# EAGLE design Gadgeteer Sponsor Board (EAGLE 6.1)
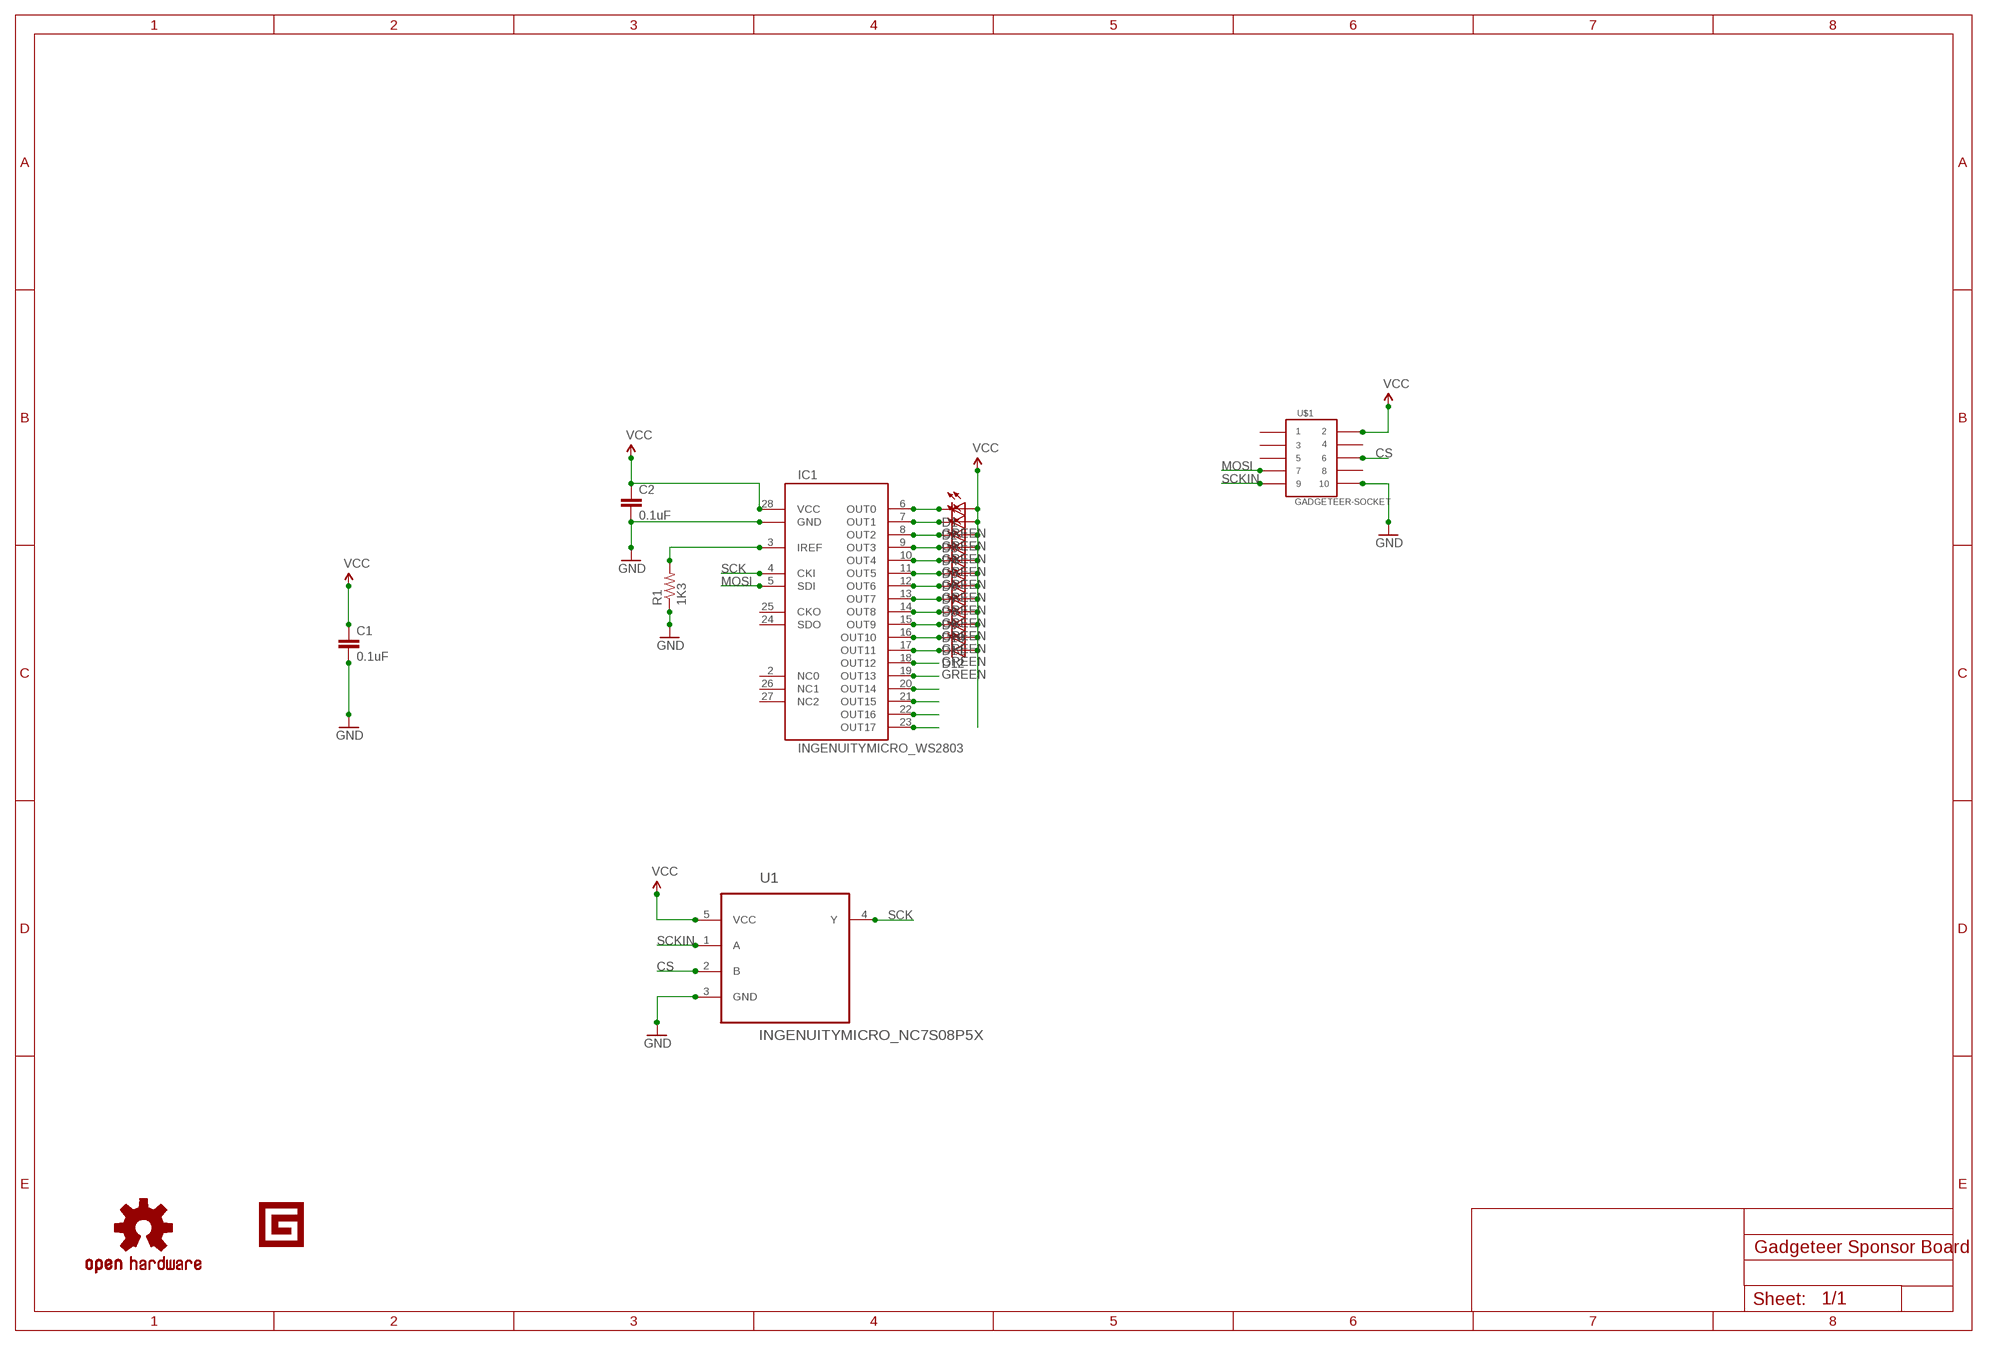
[diagram p0: schematic, sheet 1]

## Parts
C1  0.1uF  SPARKFUN_CAP0603-CAP  [SPARKFUN_0603-CAP]
C2  0.1uF  SPARKFUN_CAP0603-CAP  [SPARKFUN_0603-CAP]
D1  GREEN  LED-GREEN0603  [LED-0603]
D2  GREEN  LED-GREEN0603  [LED-0603]
D3  GREEN  LED-GREEN0603  [LED-0603]
D4  GREEN  LED-GREEN0603  [LED-0603]
D5  GREEN  LED-GREEN0603  [LED-0603]
D6  GREEN  LED-GREEN0603  [LED-0603]
D7  GREEN  LED-GREEN0603  [LED-0603]
D8  GREEN  LED-GREEN0603  [LED-0603]
D9  GREEN  LED-GREEN0603  [LED-0603]
D10  GREEN  LED-GREEN0603  [LED-0603]
D11  GREEN  LED-GREEN0603  [LED-0603]
D12  GREEN  LED-GREEN0603  [LED-0603]
IC1  INGENUITYMICRO_WS2803  [INGENUITYMICRO_SO28W]
LOGO1  OSHW-LOGOL  [OSHW-LOGO-L]
R1  1K3  RESISTOR_R-US_R0603  [RESISTOR_R0603]
U1  INGENUITYMICRO_NC7S08P5X  [INGENUITYMICRO_SOT65P210X110-5N]
U$1  GADGETEER-SOCKET  [2X5_1.27MM]
U$2  INGENUITYMICRO_LOGO_LOGO-GADGETEER-NORMAL  [INGENUITYMICRO_LOGO_GADGETEER-SILK]

## Nets
CS: U1.2(B) U$1.6
GND: C1.2 C2.2 IC1.1(GND) R1.1 U1.3(GND) U$1.10
MOSI: IC1.5(SDI) U$1.7
N$1: D1.C IC1.6(OUT0)
N$2: D2.C IC1.7(OUT1)
N$3: IC1.3(IREF) R1.2
N$4: D3.C IC1.8(OUT2)
N$5: D4.C IC1.9(OUT3)
N$6: D5.C IC1.10(OUT4)
N$7: D6.C IC1.11(OUT5)
N$8: D7.C IC1.12(OUT6)
N$9: D8.C IC1.13(OUT7)
N$10: D9.C IC1.14(OUT8)
N$11: D10.C IC1.15(OUT9)
N$12: D11.C IC1.16(OUT10)
N$13: D12.C IC1.17(OUT11)
N$14: IC1.18(OUT12)
N$15: IC1.19(OUT13)
N$16: IC1.20(OUT14)
N$17: IC1.21(OUT15)
N$18: IC1.22(OUT16)
N$19: IC1.23(OUT17)
SCK: IC1.4(CKI) U1.4(Y)
SCKIN: U1.1(A) U$1.9
VCC: C1.1 C2.1 D1.A D2.A D3.A D4.A D5.A D6.A D7.A D8.A D9.A D10.A D11.A D12.A IC1.28(VCC) U1.5(VCC) U$1.2
Unconnected: IC1.2(NC0) IC1.24(SDO) IC1.25(CKO) IC1.26(NC1) IC1.27(NC2) U$1.1 U$1.3 U$1.4 U$1.5 U$1.8

## Library data of the parts
C1 C2 = Level:SPARKFUN_CAP: Capacitor Standard 0603 ceramic capacitor, and 0.1" leaded capacitor.
D1-D12 = SparkFun-LED:LED-GREEN: Various green LEDs 0603- DIO-00821 LARGE- DIO-00862 LILYPAD- DIO-09910; PROD_ID: DIO-00821
IC1 = Level:INGENUITYMICRO_WS2803: WS2803 18-Channel Constant Current LED Driver with Programmable PWM Outputs Manufactured by Worldsemi
LOGO1 = SparkFun-Aesthetics:OSHW-LOGO: Open Source Hardware Logo This logo indicates the piece of hardware it is found on incorporates a OSHW license and/or adheres to the definition of open source hardware found here: http://freedomdefined.org/OSHW
R1 = Level:RESISTOR_R-US_: RESISTOR, American symbol
U1 = Level:INGENUITYMICRO_NC7S08P5X: 2 Input AND Gate; MPN: NC7S08P5X; OC_FARNELL: 1417655; OC_NEWARK: 58K1992; PACKAGE: SC-70-5; SUPPLIER: Fairchild Semiconductor
U$1 = SoftDust:GADGETEER-SOCKET
U$2 = Level:INGENUITYMICRO_LOGO_LOGO-GADGETEER

## Board
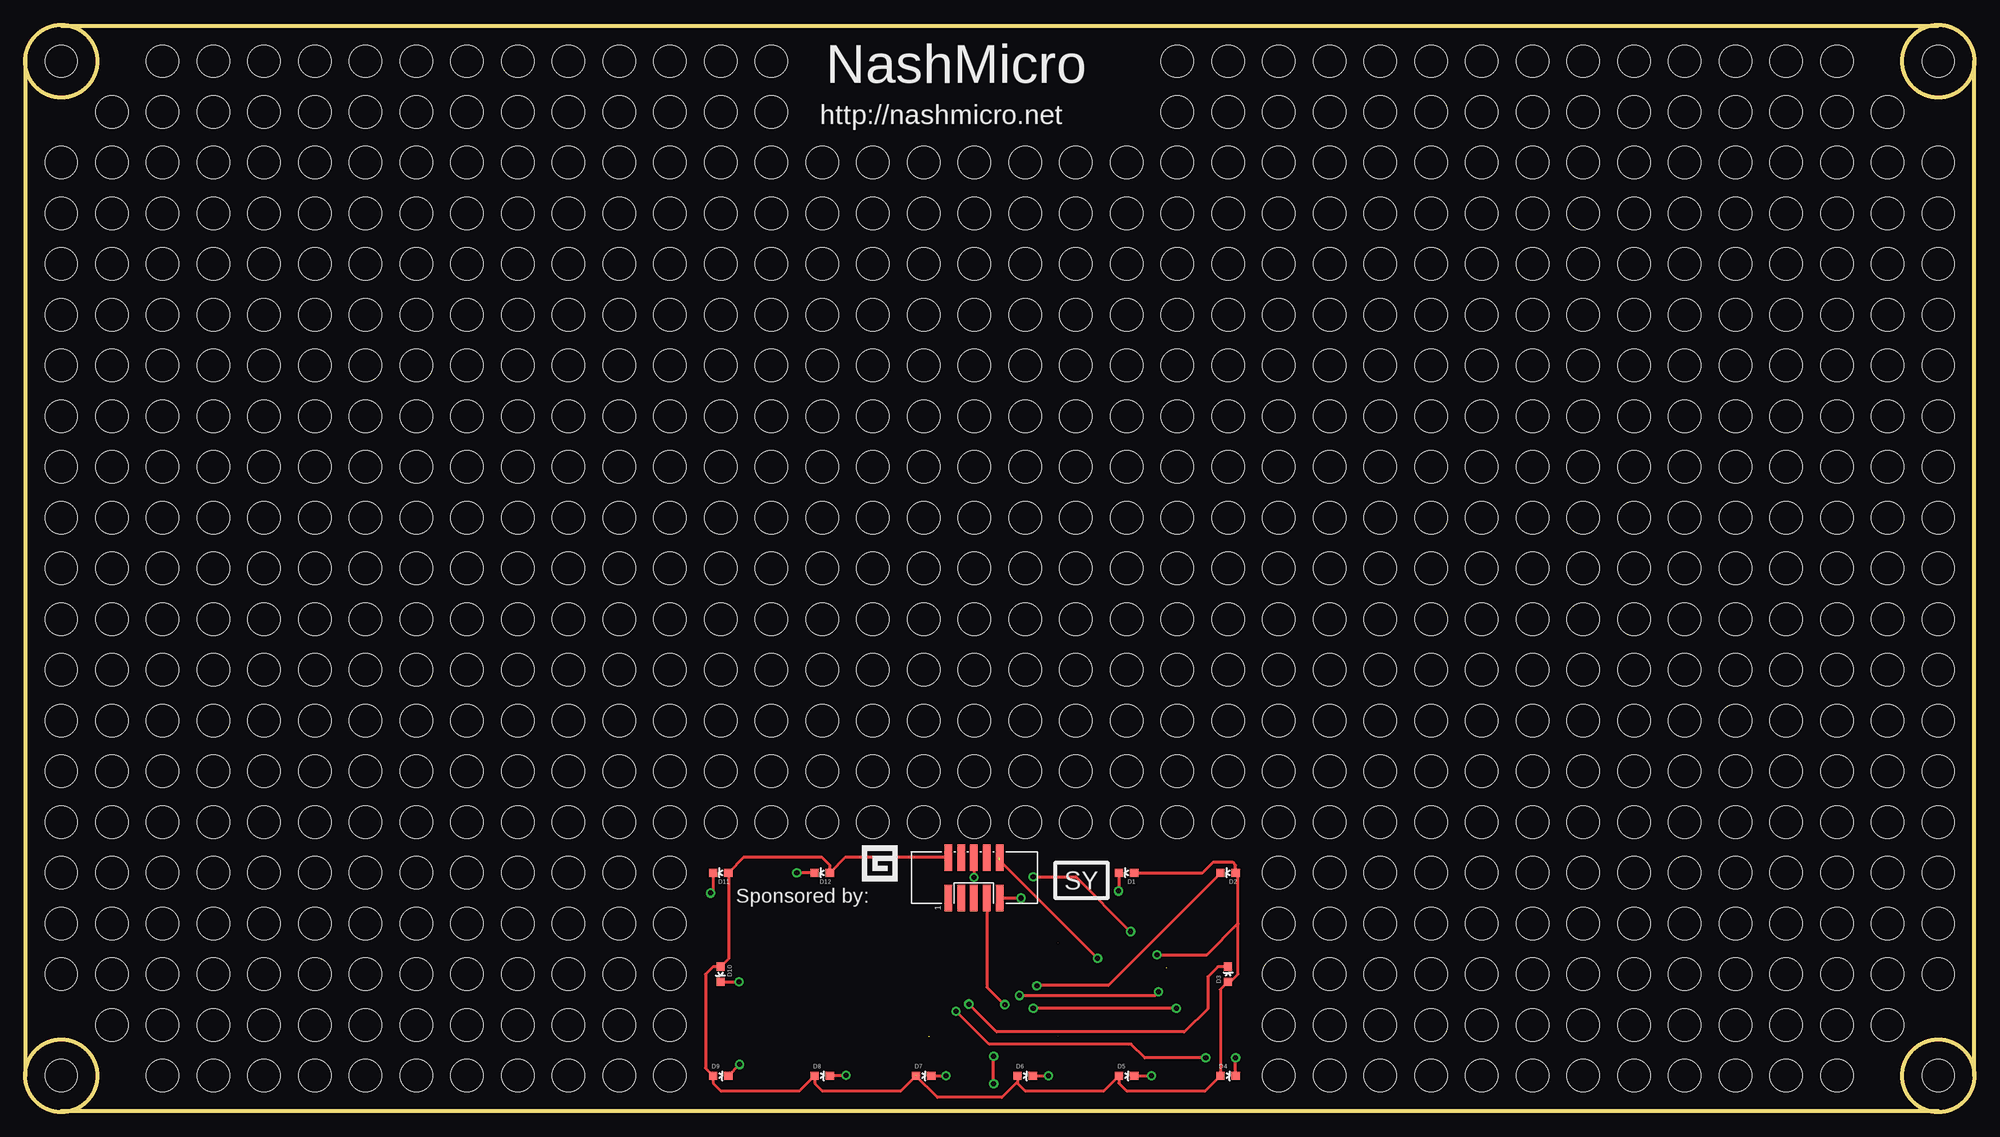
[diagram p1: board, top side]
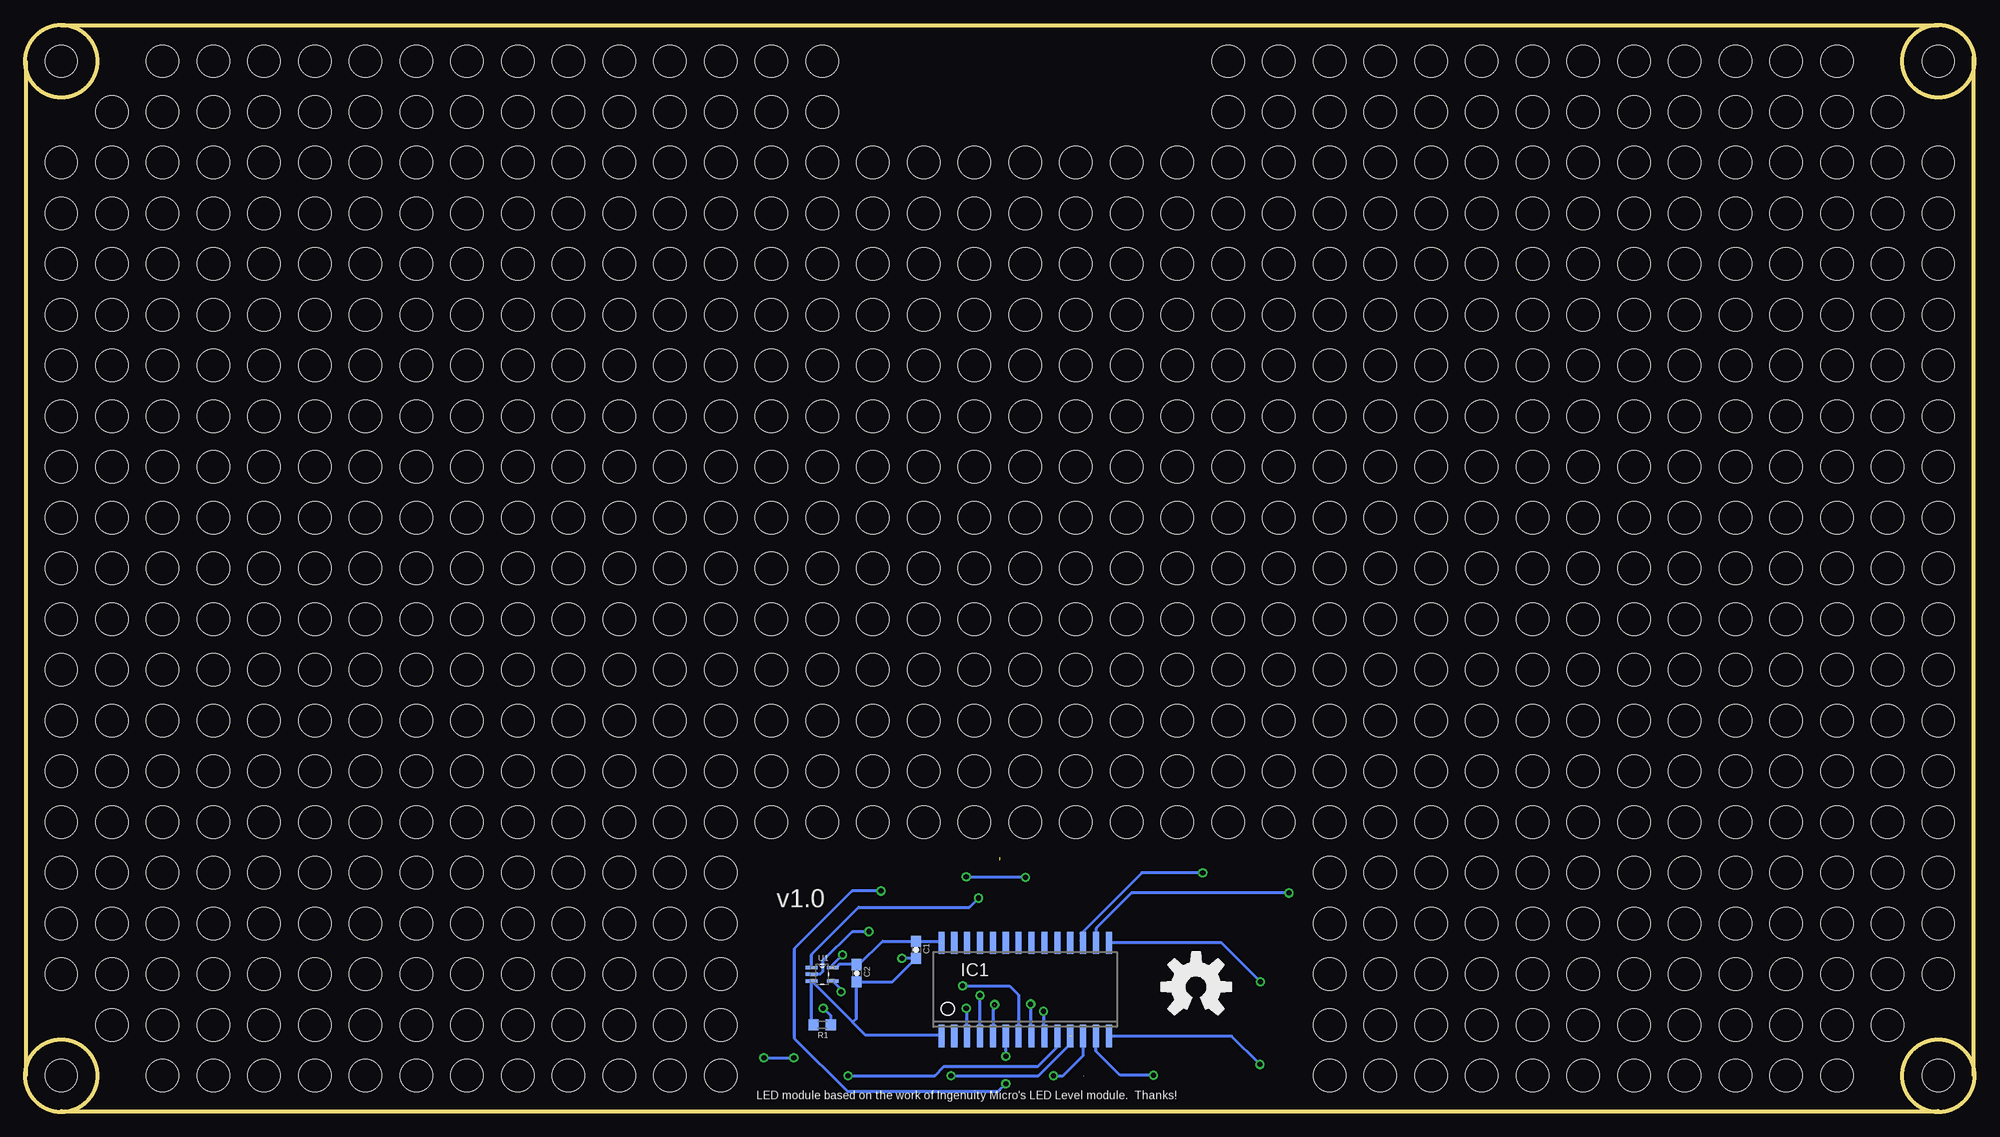
[diagram p2: board, bottom side, seen from below]

Size 192.07 x 107.07 mm. Coordinates in mm from the lower left corner, seen from the top.
Outline: 3.54,107.04 188.54,107.04
Outline: 192.04,103.54 192.04,3.54
Outline: 188.54,0.04 3.54,0.04
Outline: 0.04,3.54 0.04,104.04
Outline: circle at 3.54,103.54 radius 3.54
Outline: circle at 188.54,103.54 radius 3.54
Outline: circle at 3.54,3.54 radius 3.54
Outline: circle at 188.54,3.54 radius 3.54
Copper layers (1*16): Top 0.035mm / dielectric 1.5mm / Bottom 0.035mm
Design rules: minimum track width 6mil, minimum drill 12mil, track to track 6mil, track to pad 6mil, pad to pad 6mil, via to via 6mil, smd to smd 0mil, copper to edge 10mil, drill to drill 10mil, minimum pad ring 12mil, minimum via ring 8mil, stop-mask expansion 2mil, vias tented up to drill 25mil, thermal gap 10mil
Holes 3.2 mm at 3.54,103.54 13.54,103.54 18.54,103.54 23.54,103.54 28.54,103.54 33.54,103.54 38.54,103.54 43.54,103.54 48.54,103.54 3.54,93.54 8.54,93.54 13.54,93.54 18.54,93.54 23.54,93.54 28.54,93.54 33.54,93.54 38.54,93.54 43.54,93.54 48.54,93.54 53.54,93.54 58.54,93.54 63.54,93.54 68.54,93.54 73.54,93.54 78.54,93.54 83.54,93.54 88.54,93.54 93.54,93.54 98.54,93.54 103.54,93.54 108.54,93.54 113.54,93.54 118.54,93.54 123.54,93.54 128.54,93.54 133.54,93.54 138.54,93.54 143.54,93.54 148.54,93.54 153.54,93.54 158.54,93.54 163.54,93.54 168.54,93.54 173.54,93.54 178.54,93.54 183.54,93.54 188.54,93.54 188.54,103.54 3.54,3.54 188.54,3.54 8.54,98.54 13.54,98.54 18.54,98.54 23.54,98.54 28.54,98.54 33.54,98.54 38.54,98.54 43.54,98.54 48.54,98.54 53.54,98.54 58.54,98.54 63.54,98.54 68.54,98.54 73.54,98.54 113.54,98.54 118.54,98.54 123.54,98.54 128.54,98.54 133.54,98.54 138.54,98.54 143.54,98.54 148.54,98.54 153.54,98.54 158.54,98.54 163.54,98.54 168.54,98.54 173.54,98.54 178.54,98.54 183.54,98.54 53.54,103.54 58.54,103.54 63.54,103.54 68.54,103.54 73.54,103.54 113.54,103.54 118.54,103.54 123.54,103.54 128.54,103.54 133.54,103.54 138.54,103.54 143.54,103.54 148.54,103.54 153.54,103.54 158.54,103.54 163.54,103.54 168.54,103.54 173.54,103.54 178.54,103.54 3.54,88.54 8.54,88.54 13.54,88.54 18.54,88.54 23.54,88.54 28.54,88.54 33.54,88.54 38.54,88.54 43.54,88.54 48.54,88.54 53.54,88.54 58.54,88.54 63.54,88.54 68.54,88.54 73.54,88.54 78.54,88.54 83.54,88.54 88.54,88.54 93.54,88.54 98.54,88.54 103.54,88.54 108.54,88.54 113.54,88.54 118.54,88.54 123.54,88.54 128.54,88.54 133.54,88.54 138.54,88.54 143.54,88.54 148.54,88.54 153.54,88.54 158.54,88.54 163.54,88.54 168.54,88.54 173.54,88.54 178.54,88.54 183.54,88.54 188.54,88.54 3.54,83.54 8.54,83.54 13.54,83.54 18.54,83.54 23.54,83.54 28.54,83.54 33.54,83.54 38.54,83.54 43.54,83.54 48.54,83.54 53.54,83.54 58.54,83.54 63.54,83.54 68.54,83.54 73.54,83.54 78.54,83.54 83.54,83.54 88.54,83.54 93.54,83.54 98.54,83.54 103.54,83.54 108.54,83.54 113.54,83.54 118.54,83.54 123.54,83.54 128.54,83.54 133.54,83.54 138.54,83.54 143.54,83.54 148.54,83.54 153.54,83.54 158.54,83.54 163.54,83.54 168.54,83.54 173.54,83.54 178.54,83.54 183.54,83.54 188.54,83.54 3.54,78.54 8.54,78.54 13.54,78.54 18.54,78.54 23.54,78.54 28.54,78.54 33.54,78.54 38.54,78.54 43.54,78.54 48.54,78.54 53.54,78.54 58.54,78.54 63.54,78.54 68.54,78.54 73.54,78.54 78.54,78.54 83.54,78.54 88.54,78.54 93.54,78.54 98.54,78.54 103.54,78.54 108.54,78.54 113.54,78.54 118.54,78.54 123.54,78.54 128.54,78.54 133.54,78.54 138.54,78.54 143.54,78.54 148.54,78.54 153.54,78.54 158.54,78.54 163.54,78.54 168.54,78.54 173.54,78.54 178.54,78.54 183.54,78.54 188.54,78.54 3.54,73.54 8.54,73.54 13.54,73.54 18.54,73.54 23.54,73.54 28.54,73.54 33.54,73.54 38.54,73.54 43.54,73.54 48.54,73.54 53.54,73.54 58.54,73.54 63.54,73.54 68.54,73.54 73.54,73.54 78.54,73.54 83.54,73.54 88.54,73.54 93.54,73.54 98.54,73.54 103.54,73.54 108.54,73.54 113.54,73.54 118.54,73.54 123.54,73.54 128.54,73.54 133.54,73.54 138.54,73.54 143.54,73.54 148.54,73.54 153.54,73.54 158.54,73.54 163.54,73.54 168.54,73.54 173.54,73.54 178.54,73.54 183.54,73.54 188.54,73.54 3.54,68.54 8.54,68.54 13.54,68.54 18.54,68.54 23.54,68.54 28.54,68.54 33.54,68.54 38.54,68.54 43.54,68.54 48.54,68.54 53.54,68.54 58.54,68.54 63.54,68.54 68.54,68.54 73.54,68.54 78.54,68.54 83.54,68.54 88.54,68.54 93.54,68.54 98.54,68.54 103.54,68.54 108.54,68.54 113.54,68.54 118.54,68.54 123.54,68.54 128.54,68.54 133.54,68.54 138.54,68.54 143.54,68.54 148.54,68.54 153.54,68.54 158.54,68.54 163.54,68.54 168.54,68.54 173.54,68.54 178.54,68.54 183.54,68.54 188.54,68.54 3.54,63.54 8.54,63.54 13.54,63.54 18.54,63.54 23.54,63.54 28.54,63.54 33.54,63.54 38.54,63.54 43.54,63.54 48.54,63.54 53.54,63.54 58.54,63.54 63.54,63.54 68.54,63.54 73.54,63.54 78.54,63.54 83.54,63.54 88.54,63.54 93.54,63.54 98.54,63.54 103.54,63.54 108.54,63.54 113.54,63.54 118.54,63.54 123.54,63.54 128.54,63.54 133.54,63.54 138.54,63.54 143.54,63.54 148.54,63.54 153.54,63.54 158.54,63.54 163.54,63.54 168.54,63.54 173.54,63.54 178.54,63.54 183.54,63.54 188.54,63.54 3.54,58.54 8.54,58.54 13.54,58.54 18.54,58.54 23.54,58.54 28.54,58.54 33.54,58.54 38.54,58.54 43.54,58.54 48.54,58.54 53.54,58.54 58.54,58.54 63.54,58.54 68.54,58.54 73.54,58.54 78.54,58.54 83.54,58.54 88.54,58.54 93.54,58.54 98.54,58.54 103.54,58.54 108.54,58.54 113.54,58.54 118.54,58.54 123.54,58.54 128.54,58.54 133.54,58.54 138.54,58.54 143.54,58.54 148.54,58.54 153.54,58.54 158.54,58.54 163.54,58.54 168.54,58.54 173.54,58.54 178.54,58.54 183.54,58.54 188.54,58.54 3.54,53.54 8.54,53.54 13.54,53.54 18.54,53.54 23.54,53.54 28.54,53.54 33.54,53.54 38.54,53.54 43.54,53.54 48.54,53.54 53.54,53.54 58.54,53.54 63.54,53.54 68.54,53.54 73.54,53.54 78.54,53.54 83.54,53.54 88.54,53.54 93.54,53.54 98.54,53.54 103.54,53.54 108.54,53.54 113.54,53.54 118.54,53.54 123.54,53.54 128.54,53.54 133.54,53.54 138.54,53.54 143.54,53.54 148.54,53.54 153.54,53.54 158.54,53.54 163.54,53.54 168.54,53.54 173.54,53.54 178.54,53.54 183.54,53.54 188.54,53.54 3.54,48.54 8.54,48.54 13.54,48.54 18.54,48.54 23.54,48.54 28.54,48.54 33.54,48.54 38.54,48.54 43.54,48.54 48.54,48.54 53.54,48.54 58.54,48.54 63.54,48.54 68.54,48.54 73.54,48.54 78.54,48.54 83.54,48.54 88.54,48.54 93.54,48.54 98.54,48.54 103.54,48.54 108.54,48.54 113.54,48.54 118.54,48.54 123.54,48.54 128.54,48.54 133.54,48.54 138.54,48.54 143.54,48.54 148.54,48.54 153.54,48.54 158.54,48.54 163.54,48.54 168.54,48.54 173.54,48.54 178.54,48.54 183.54,48.54 188.54,48.54 3.54,43.54 8.54,43.54 13.54,43.54 18.54,43.54 23.54,43.54 28.54,43.54 33.54,43.54 38.54,43.54 43.54,43.54 48.54,43.54 53.54,43.54 58.54,43.54 63.54,43.54 68.54,43.54 73.54,43.54 78.54,43.54 83.54,43.54 88.54,43.54 93.54,43.54 98.54,43.54 103.54,43.54 108.54,43.54 113.54,43.54 118.54,43.54 123.54,43.54 128.54,43.54 133.54,43.54 138.54,43.54 143.54,43.54 148.54,43.54 153.54,43.54 158.54,43.54 163.54,43.54 168.54,43.54 173.54,43.54 178.54,43.54 183.54,43.54 188.54,43.54 3.54,38.54 8.54,38.54 13.54,38.54 18.54,38.54 23.54,38.54 28.54,38.54 33.54,38.54 38.54,38.54 43.54,38.54 48.54,38.54 53.54,38.54 58.54,38.54 63.54,38.54 68.54,38.54 73.54,38.54 78.54,38.54 83.54,38.54 88.54,38.54 93.54,38.54 98.54,38.54 103.54,38.54 108.54,38.54 113.54,38.54 118.54,38.54 123.54,38.54 128.54,38.54 133.54,38.54 138.54,38.54 143.54,38.54 148.54,38.54 153.54,38.54 158.54,38.54 163.54,38.54 168.54,38.54 173.54,38.54 178.54,38.54 183.54,38.54 188.54,38.54 3.54,33.54 8.54,33.54 13.54,33.54 18.54,33.54 23.54,33.54 28.54,33.54 33.54,33.54 38.54,33.54 43.54,33.54 48.54,33.54 53.54,33.54 58.54,33.54 63.54,33.54 68.54,33.54 73.54,33.54 78.54,33.54 83.54,33.54 88.54,33.54 93.54,33.54 98.54,33.54 103.54,33.54 108.54,33.54 113.54,33.54 118.54,33.54 123.54,33.54 128.54,33.54 133.54,33.54 138.54,33.54 143.54,33.54 148.54,33.54 153.54,33.54 158.54,33.54 163.54,33.54 168.54,33.54 173.54,33.54 178.54,33.54 183.54,33.54 188.54,33.54 3.54,28.54 8.54,28.54 13.54,28.54 18.54,28.54 23.54,28.54 28.54,28.54 33.54,28.54 38.54,28.54 43.54,28.54 48.54,28.54 53.54,28.54 58.54,28.54 63.54,28.54 68.54,28.54 73.54,28.54 78.54,28.54 83.54,28.54 88.54,28.54 93.54,28.54 98.54,28.54 103.54,28.54 108.54,28.54 113.54,28.54 118.54,28.54 123.54,28.54 128.54,28.54 133.54,28.54 138.54,28.54 143.54,28.54 148.54,28.54 153.54,28.54 158.54,28.54 163.54,28.54 168.54,28.54 173.54,28.54 178.54,28.54 183.54,28.54 188.54,28.54 3.54,23.54 8.54,23.54 13.54,23.54 18.54,23.54 23.54,23.54 28.54,23.54 33.54,23.54 38.54,23.54 43.54,23.54 48.54,23.54 53.54,23.54 58.54,23.54 63.54,23.54 123.54,23.54 128.54,23.54 133.54,23.54 138.54,23.54 143.54,23.54 148.54,23.54 153.54,23.54 158.54,23.54 163.54,23.54 168.54,23.54 173.54,23.54 178.54,23.54 183.54,23.54 188.54,23.54 3.54,18.54 8.54,18.54 13.54,18.54 18.54,18.54 23.54,18.54 28.54,18.54 33.54,18.54 38.54,18.54 43.54,18.54 48.54,18.54 53.54,18.54 58.54,18.54 63.54,18.54 123.54,18.54 128.54,18.54 133.54,18.54 138.54,18.54 143.54,18.54 148.54,18.54 153.54,18.54 158.54,18.54 163.54,18.54 168.54,18.54 173.54,18.54 178.54,18.54 183.54,18.54 188.54,18.54 3.54,13.54 8.54,13.54 13.54,13.54 18.54,13.54 23.54,13.54 28.54,13.54 33.54,13.54 38.54,13.54 43.54,13.54 48.54,13.54 53.54,13.54 58.54,13.54 63.54,13.54 123.54,13.54 128.54,13.54 133.54,13.54 138.54,13.54 143.54,13.54 148.54,13.54 153.54,13.54 158.54,13.54 163.54,13.54 168.54,13.54 173.54,13.54 178.54,13.54 183.54,13.54 188.54,13.54 8.54,8.54 13.54,8.54 18.54,8.54 23.54,8.54 28.54,8.54 33.54,8.54 38.54,8.54 43.54,8.54 48.54,8.54 53.54,8.54 58.54,8.54 63.54,8.54 123.54,8.54 128.54,8.54 133.54,8.54 138.54,8.54 143.54,8.54 148.54,8.54 153.54,8.54 158.54,8.54 163.54,8.54 168.54,8.54 173.54,8.54 178.54,8.54 183.54,8.54 13.54,3.54 18.54,3.54 23.54,3.54 28.54,3.54 33.54,3.54 38.54,3.54 43.54,3.54 48.54,3.54 53.54,3.54 58.54,3.54 63.54,3.54 123.54,3.54 128.54,3.54 133.54,3.54 138.54,3.54 143.54,3.54 148.54,3.54 153.54,3.54 158.54,3.54 163.54,3.54 168.54,3.54 173.54,3.54 178.54,3.54
tKeepout: area 2.1,102.1 to 5,105; area 12.1,102.1 to 15,105; area 17.1,102.1 to 20,105; area 22.1,102.1 to 25,105; area 27.1,102.1 to 30,105; area 32.1,102.1 to 35,105; area 37.1,102.1 to 40,105; area 42.1,102.1 to 45,105; area 47.1,102.1 to 50,105; area 2.1,92.1 to 5,95; area 7.1,92.1 to 10,95; area 12.1,92.1 to 15,95; 709 more areas

### Footprints (pad centres in the part's own frame; a part is rotated, then mirrored left to right if it is on the bottom)
SPARKFUN_0603-CAP = smd 1.1 x 1: 1 -0.85,0; 2 0.85,0
LED-0603 = smd 0.8 x 0.8: A 0,-0.75; C 0,0.75
INGENUITYMICRO_SO28W = smd 0.6 x 2.2: 1 -8.255,-4.6; 2 -6.985,-4.6; 3 -5.715,-4.6; 4 -4.445,-4.6; 5 -3.175,-4.6; 6 -1.905,-4.6; 7 -0.635,-4.6; 8 0.635,-4.6; 9 1.905,-4.6; 10 3.175,-4.6; 11 4.445,-4.6; 12 5.715,-4.6; 13 6.985,-4.6; 14 8.255,-4.6; 15 8.255,4.6; 16 6.985,4.6; 17 5.715,4.6; 18 4.445,4.6; 19 3.175,4.6; 20 1.905,4.6; 21 0.635,4.6; 22 -0.635,4.6; 23 -1.905,4.6; 24 -3.175,4.6; 25 -4.445,4.6; 26 -5.715,4.6; 27 -6.985,4.6; 28 -8.255,4.6
RESISTOR_R0603 = smd 1 x 1.1: 1 -0.85,0; 2 0.85,0
INGENUITYMICRO_SOT65P210X110-5N = smd 1.168 x 0.356: 1 -1.041,0.66; 2 -1.041,0; 3 -1.041,-0.66; 4 1.041,-0.66; 5 1.041,0.66
2X5_1.27MM = smd 2.6 x 0.74: 1 -2,2.58; 2 2,2.58; 3 -2,1.31; 4 2,1.31; 5 -2,0.04; 6 2,0.04; 7 -2,-1.23; 8 2,-1.23; 9 -2,-2.5; 10 2,-2.5

### Placement (x,y rotation side)
C1  104.29,15.94 270 bottom
C2  110.14,13.64 270 bottom
D1  108.54,23.54 90 top
D2  118.54,23.54 90 top
D3  118.54,13.54 0 top
D4  118.54,3.54 270 top
D5  108.54,3.54 270 top
D6  98.54,3.54 270 top
D7  88.54,3.54 270 top
D8  78.54,3.54 270 top
D9  68.54,3.54 270 top
D10  68.54,13.54 180 top
D11  68.54,23.54 90 top
D12  78.54,23.54 90 top
IC1  93.54,12.04 0 bottom
LOGO1  76.69,12.29 0 bottom
R1  113.54,8.54 0 bottom
U1  113.54,13.54 0 bottom
U$1  93.54,23.04 90 top
U$2  84.64,24.89 0 top

### Tracks (layer width: path | path; a pad name or v marks a point on that pad's centre or on a via)
CS  (via drill 0.5)
  Top 0.305: U$1.6 v93.5,23.1 v93.49,23.09 | v99.34,23.14 103.54,23.14 v108.94,17.74
  Bottom 0.305: v93.49,23.09 99.29,23.09 v99.34,23.14 | v108.94,17.74 110.59,17.74 113.49,14.84 113.49,13.79 113.74,13.54 U1.2
GND  (via drill 0.5)  (2 unrouted)
  Top 0.305: v105.69,15.09 96.04,24.74
  Bottom 0.305: R1.1 114.58,8.73 U1.3 110.54,8.83 110.54,8.79 | 110.54,8.79 110.19,9.14 110.19,12.74 C2.2 106.59,12.79 C1.2 v105.69,15.09 | IC1.1 101.89,7.54 109.29,7.54 110.54,8.79
  Bottom 0.406: C1.2 104.24,15.14
MOSI  (via drill 0.5)  (1 unrouted)
  Top 0.305: U$1.7 94.77,12.26 96.54,10.49
  Bottom 0.305: v96.54,10.54 96.71,10.36 IC1.5
N$1  (via drill 0.5)
  Top 0.305: D1.C 107.79,21.79 v107.74,21.74 | v95.44,2.74 v95.44,5.44
  Bottom 0.305: v107.74,21.74 110.59,21.74 116.29,16.04 116.29,7.24 111.04,1.99 96.19,1.99 v95.44,2.74 | v95.44,5.44 IC1.6
N$2  (via drill 0.5)
  Top 0.305: D2.C 117.79,23.49 106.74,12.44 99.74,12.44 v99.69,12.39
  Bottom 0.305: v99.69,12.39 95.09,12.39 94.19,11.49 94.19,7.45 IC1.7
N$3  (via drill 0.5)
  Top 0.305: v113.44,10.19 v99.34,10.19
  Bottom 0.305: R1.2 112.69,9.44 v113.44,10.19 | v99.34,10.19 99.34,7.52 IC1.3
N$4  (via drill 0.5)
  Top 0.305: D3.C 117.54,14.29 116.54,13.29 116.54,10.14 114.24,7.84 95.74,7.84 v92.99,10.59
  Bottom 0.305: v92.99,10.59 92.99,7.52 IC1.8
N$5  (via drill 0.5)
  Top 0.305: D4.C v119.29,5.29 | v116.34,5.29 110.34,5.29 108.99,6.64 94.99,6.64 v91.74,9.89
  Bottom 0.305: v119.29,5.29 v116.34,5.29 | v91.74,9.89 91.74,7.54 IC1.9
N$6  (via drill 0.5)
  Top 0.305: D5.C v110.99,3.54
  Bottom 0.305: v110.99,3.54 102.44,3.54 101.54,4.44 92.29,4.44 90.39,6.34 90.39,7.41 IC1.10
N$7  (via drill 0.5)  (1 unrouted)
  Top 0.305: D6.C v100.84,3.54
  Bottom 0.305: v100.84,3.54 92.24,3.54 89.19,6.59 89.19,7.24 89.04,7.39 89.04,7.44 | IC1.11
N$8  (via drill 0.5)
  Top 0.305: D7.C v90.74,3.54
  Bottom 0.305: v90.74,3.54 89.79,3.54 87.79,5.54 87.79,7.4 IC1.12
N$9  (via drill 0.5)
  Top 0.305: D8.C 79.34,3.59 v80.89,3.59
  Bottom 0.305: v80.89,3.59 84.19,3.59 86.54,5.94 86.54,7.42 IC1.13
N$10  (via drill 0.5)
  Top 0.305: D9.C v70.39,4.64
  Bottom 0.305: v70.39,4.64 73.19,7.44 IC1.14
N$11  (via drill 0.5)
  Top 0.305: D10.C v70.34,12.79
  Bottom 0.305: v70.34,12.79 74.19,16.64 IC1.15
N$12  (via drill 0.5)
  Top 0.305: D11.C 67.79,21.79 v67.54,21.54
  Bottom 0.305: v67.54,21.54 83.04,21.54 86.54,18.04 86.54,16.65 IC1.16
N$13  (via drill 0.5)
  Top 0.305: D12.C v76.04,23.54
  Bottom 0.305: v76.04,23.54 82.04,23.54 88.04,17.54 88.04,16.85 IC1.17
SCK  (via drill 0.5)
  Top 0.305: v97.99,11.44 111.34,11.44 v111.69,11.79
  Bottom 0.305: IC1.4 v97.98,11.43 v97.99,11.44 | v111.69,11.79 111.69,12.07 U1.4
SCKIN  (via drill 0.5)
  Top 0.305: v98.14,21.04 U$1.9
  Bottom 0.305: U1.1 114.58,15.49 109.94,20.14 99.04,20.14 v98.14,21.04
VCC  (via drill 0.5)  (3 unrouted)
  Top 0.305: D1.A 116.04,23.54 117.04,24.54 119.04,24.54 119.29,24.29 D2.A arc-90 119.54,23.29 119.54,18.54 | U$1.2 80.79,25.04 D12.A 79.29,24.29 78.54,25.04 70.79,25.04 D11.A 69.29,15.04 D10.A 67.79,14.29 67.04,13.54 67.04,4.29 D9.A 67.79,2.79 68.54,2.04 76.29,2.04 D8.A 77.79,2.79 78.54,2.04 86.29,2.04 D7.A | 119.54,18.54 119.54,13.54 118.79,12.79 D3.A 117.79,12.04 D4.A 116.29,2.04 108.54,2.04 107.79,2.79 D5.A 106.29,2.04 98.54,2.04 97.79,2.79 D6.A 97.79,2.94 96.24,1.39 89.89,1.39 87.74,3.54 | v111.54,15.44 116.44,15.44 119.54,18.54
  Bottom 0.305: 101.74,17.04 101.74,16.49 101.79,16.54 IC1.28 101.94,16.79 C1.1 107.59,16.79 109.89,14.49 C2.1 111.84,14.49 112.14,14.19 U1.5 112.54,14.14 112.54,14.44 v111.54,15.44

### Text on the board
tPlace: Sponsored by:
tNames: NashMicro | http://nashmicro.net | SY
bNames: v1.0 | LED module based on the work of Ingenuity Micro's LED Level module. Thanks!